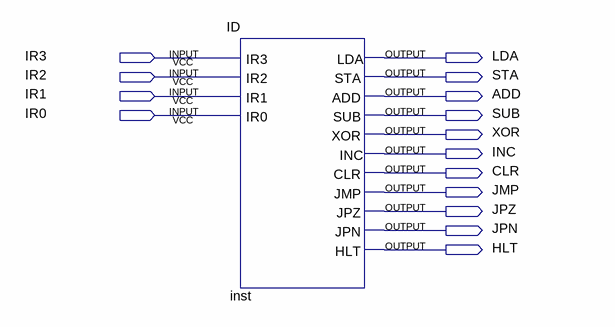
[diagram p0: schematic sheet]
// Quartus schematic HW8.bdf as structural Verilog: 1 symbols, 15 pins
module HW8 (
  input  IR3,
  input  IR2,
  input  IR1,
  input  IR0,
  output LDA,
  output STA,
  output ADD,
  output SUB,
  output XOR,
  output INC,
  output CLR,
  output JMP,
  output JPZ,
  output JPN,
  output HLT
);

  ID inst (
    .IR3(IR3), .IR2(IR2), .IR1(IR1), .IR0(IR0), .LDA(LDA), .STA(STA), .ADD(ADD), .SUB(SUB), .XOR(XOR),
    .INC(INC), .CLR(CLR), .JMP(JMP), .JPZ(JPZ), .JPN(JPN), .HLT(HLT));
endmodule
